# Altium schematic sheet Interface.SchDoc
size A3; SheetNumber: 1; SheetTotal: 10
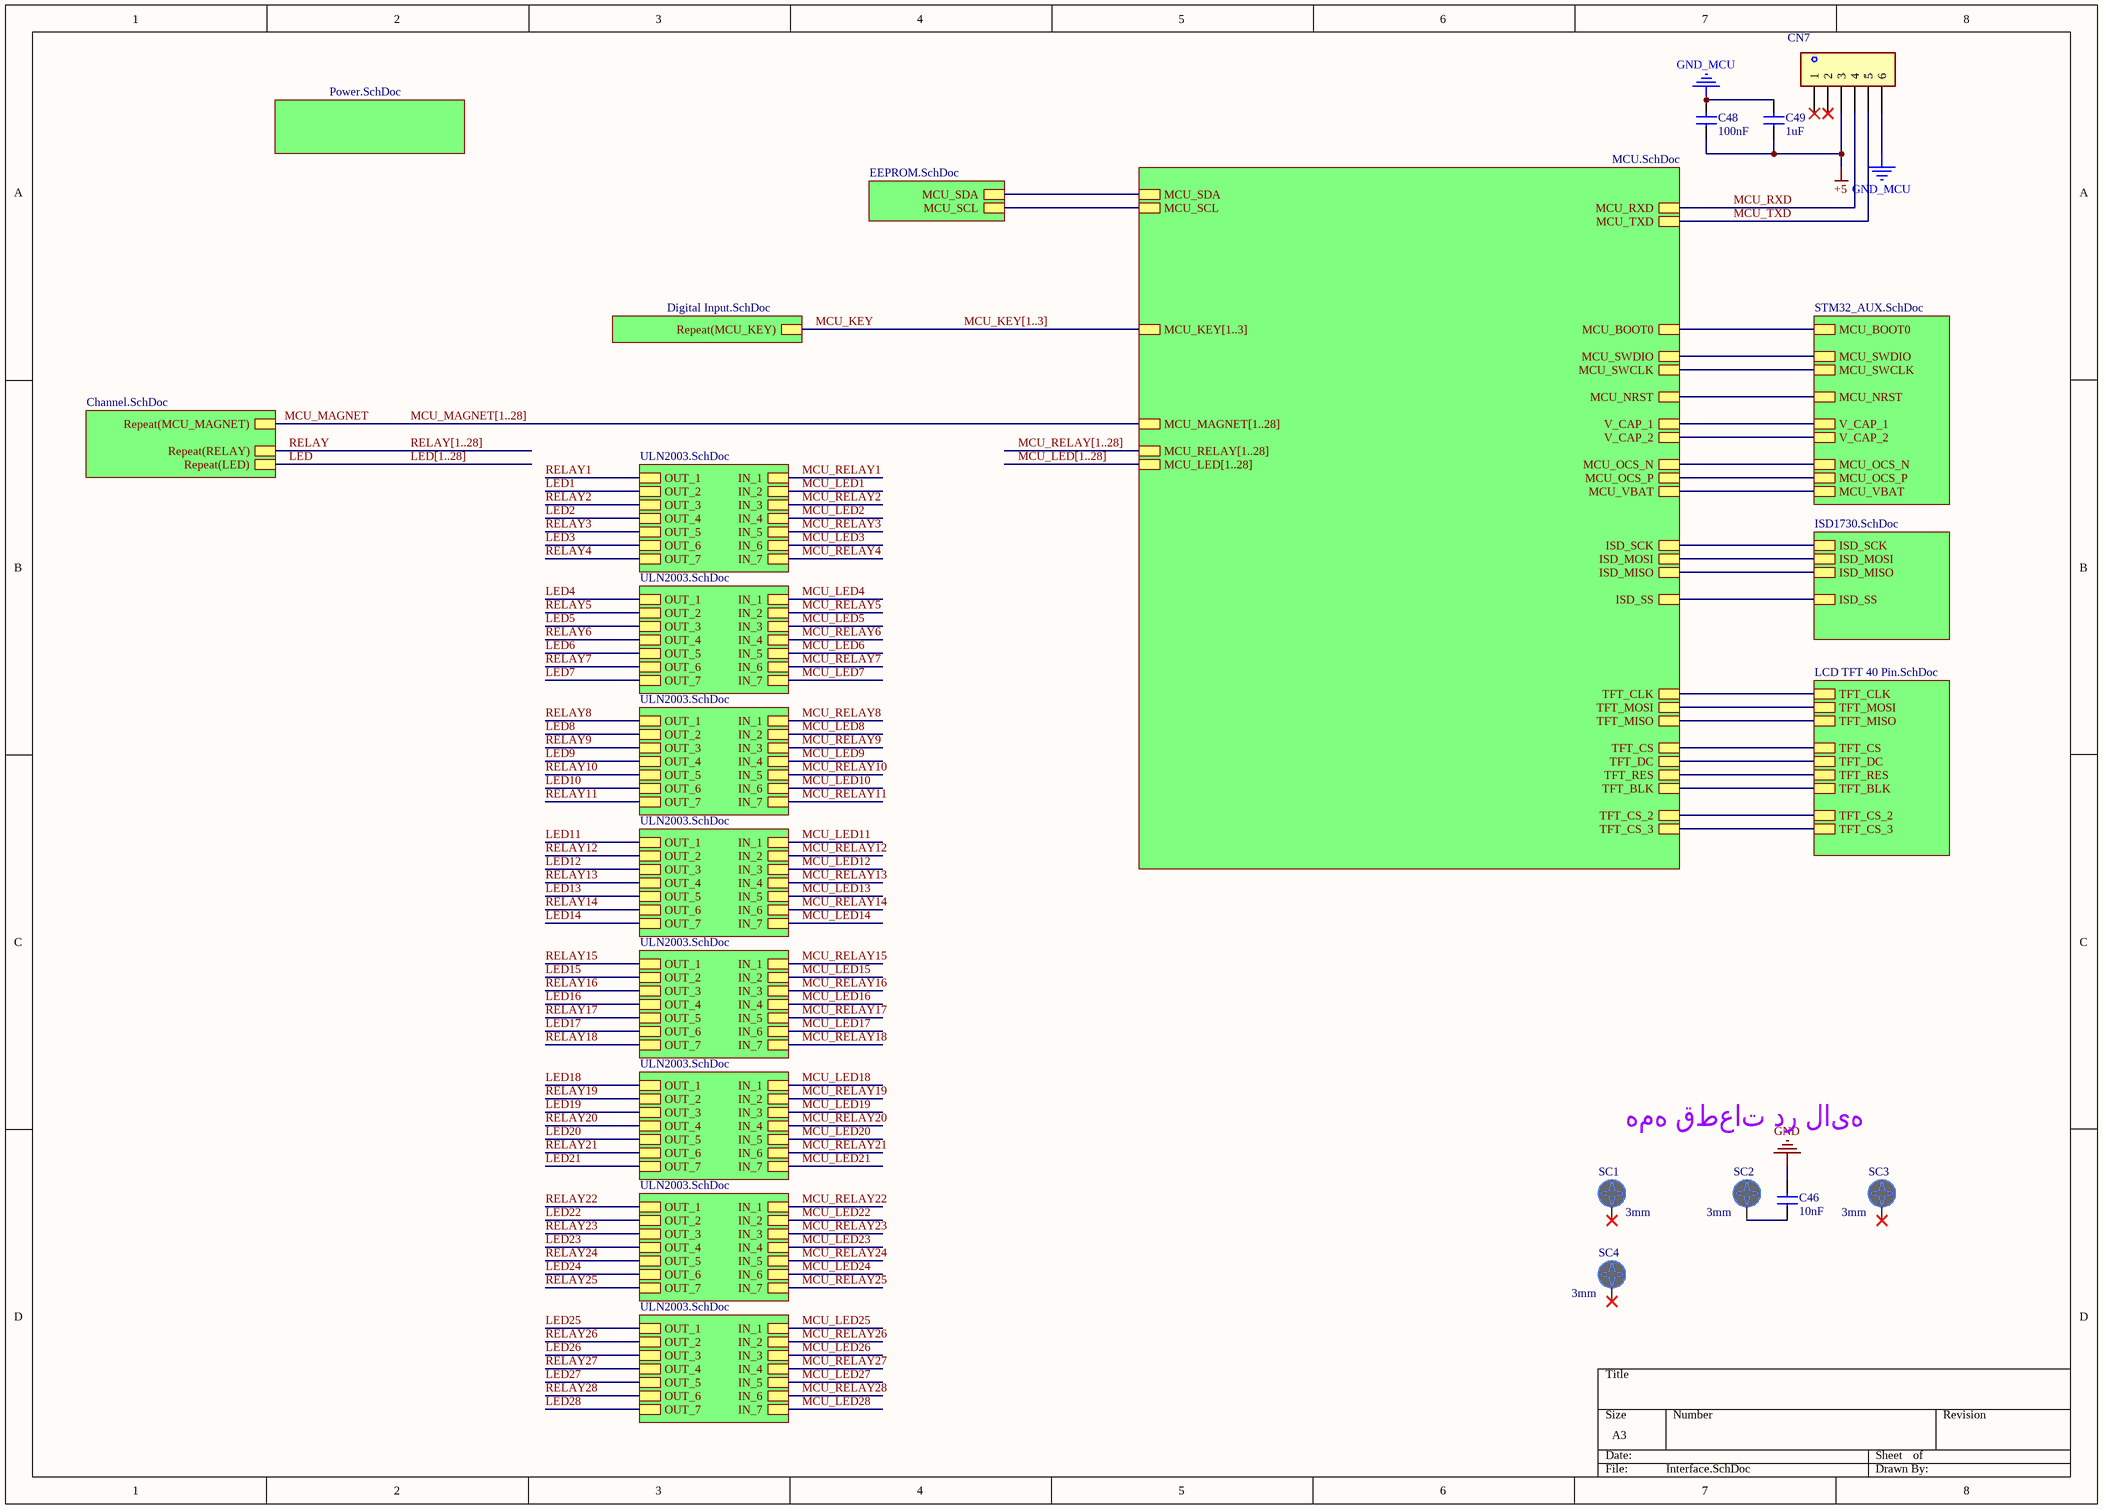
[diagram p0: Interface.SchDoc]

## Parts
C46  value 10nF  [CAP-CER-13x5-Ls10]  (hidden comment: CAP Cer 10nF-1KV-X7R-THD)
C48  value 100nF  [C-0805]  (hidden comment: CAP Cer 100nF-50V-X7R-SMD)
C49  value 1uF  [C-0805]  (hidden comment: CAP Cer 1uF-50V-X7R-SMD)
CN7  Connector XH/VH/TE-Straight/Right-THD/SMD-?mm  [XH-6]  (value not drawn)
SC1  Size: 3mm  [Screw_M3]  (hidden comment: Screw 3mm)
SC2  Size: 3mm  [Screw_M3]  (hidden comment: Screw 3mm)
SC3  Size: 3mm  [Screw_M3]  (hidden comment: Screw 3mm)
SC4  Size: 3mm  [Screw_M3]  (hidden comment: Screw 3mm)

## Sub-sheets
EEPROM = EEPROM.SchDoc: MCU_SDA, MCU_SCL
ISD1730 = ISD1730.SchDoc: ISD_SCK, ISD_MOSI, ISD_MISO, ISD_SS
MCU = MCU.SchDoc: MCU_BOOT0, MCU_SWCLK, MCU_SWDIO, MCU_NRST, V_CAP_1, V_CAP_2, MCU_OCS_N, MCU_OCS_P, TFT_CS, TFT_CLK, TFT_DC, TFT_MOSI, TFT_MISO, TFT_RES, TFT_BLK, ISD_SCK, ISD_MOSI, ISD_MISO, ISD_SS, MCU_SDA, MCU_SCL, MCU_KEY[1..3], MCU_RELAY[1..28], MCU_LED[1..28], MCU_MAGNET[1..28], MCU_TXD, MCU_RXD, MCU_VBAT, TFT_CS_2, TFT_CS_3
Power = Power.SchDoc: no entries
Repeat(CHANNEL, 1, 28) = Channel.SchDoc: Repeat(RELAY), Repeat(LED), Repeat(MCU_MAGNET)
Repeat(KEY, 1, 3) = Digital Input.SchDoc: Repeat(MCU_KEY)
STM_AUX = STM32_AUX.SchDoc: MCU_BOOT0, MCU_SWCLK, MCU_SWDIO, MCU_NRST, V_CAP_1, V_CAP_2, MCU_OCS_N, MCU_OCS_P, MCU_VBAT
TFT = LCD TFT 40 Pin.SchDoc: TFT_CS, TFT_CLK, TFT_DC, TFT_MOSI, TFT_MISO, TFT_RES, TFT_BLK, TFT_CS_2, TFT_CS_3
ULN2003_1 = ULN2003.SchDoc: IN_1, IN_2, IN_3, IN_4, IN_5, IN_6, IN_7, OUT_1, OUT_2, OUT_3, OUT_4, OUT_5, OUT_6, OUT_7
ULN2003_2 = ULN2003.SchDoc: IN_1, IN_2, IN_3, IN_4, IN_5, IN_6, IN_7, OUT_1, OUT_2, OUT_3, OUT_4, OUT_5, OUT_6, OUT_7
ULN2003_3 = ULN2003.SchDoc: IN_1, IN_2, IN_3, IN_4, IN_5, IN_6, IN_7, OUT_1, OUT_2, OUT_3, OUT_4, OUT_5, OUT_6, OUT_7
ULN2003_4 = ULN2003.SchDoc: IN_1, IN_2, IN_3, IN_4, IN_5, IN_6, IN_7, OUT_1, OUT_2, OUT_3, OUT_4, OUT_5, OUT_6, OUT_7
ULN2003_5 = ULN2003.SchDoc: IN_1, IN_2, IN_3, IN_4, IN_5, IN_6, IN_7, OUT_1, OUT_2, OUT_3, OUT_4, OUT_5, OUT_6, OUT_7
ULN2003_6 = ULN2003.SchDoc: IN_1, IN_2, IN_3, IN_4, IN_5, IN_6, IN_7, OUT_1, OUT_2, OUT_3, OUT_4, OUT_5, OUT_6, OUT_7
ULN2003_7 = ULN2003.SchDoc: IN_1, IN_2, IN_3, IN_4, IN_5, IN_6, IN_7, OUT_1, OUT_2, OUT_3, OUT_4, OUT_5, OUT_6, OUT_7
ULN2003_8 = ULN2003.SchDoc: IN_1, IN_2, IN_3, IN_4, IN_5, IN_6, IN_7, OUT_1, OUT_2, OUT_3, OUT_4, OUT_5, OUT_6, OUT_7

## Nets
+5: C48.1 C49.1 CN7.3
GND: C46.2
GND_MCU: C48.2 C49.2 CN7.6
LED: sheet Repeat(CHANNEL, 1, 28)/Repeat(LED)
LED1: sheet ULN2003_1/OUT_2
LED2: sheet ULN2003_1/OUT_4
LED3: sheet ULN2003_1/OUT_6
LED4: sheet ULN2003_2/OUT_1
LED5: sheet ULN2003_2/OUT_3
LED6: sheet ULN2003_2/OUT_5
LED7: sheet ULN2003_2/OUT_7
LED8: sheet ULN2003_3/OUT_2
LED9: sheet ULN2003_3/OUT_4
LED10: sheet ULN2003_3/OUT_6
LED11: sheet ULN2003_4/OUT_1
LED12: sheet ULN2003_4/OUT_3
LED13: sheet ULN2003_4/OUT_5
LED14: sheet ULN2003_4/OUT_7
LED15: sheet ULN2003_5/OUT_2
LED16: sheet ULN2003_5/OUT_4
LED17: sheet ULN2003_5/OUT_6
LED18: sheet ULN2003_6/OUT_1
LED19: sheet ULN2003_6/OUT_3
LED20: sheet ULN2003_6/OUT_5
LED21: sheet ULN2003_6/OUT_7
LED22: sheet ULN2003_7/OUT_2
LED23: sheet ULN2003_7/OUT_4
LED24: sheet ULN2003_7/OUT_6
LED25: sheet ULN2003_8/OUT_1
LED26: sheet ULN2003_8/OUT_3
LED27: sheet ULN2003_8/OUT_5
LED28: sheet ULN2003_8/OUT_7
MCU_KEY: sheet Repeat(KEY, 1, 3)/Repeat(MCU_KEY)  [also labelled MCU_KEY[1..3]]
MCU_LED1: sheet ULN2003_1/IN_2
MCU_LED2: sheet ULN2003_1/IN_4
MCU_LED3: sheet ULN2003_1/IN_6
MCU_LED4: sheet ULN2003_2/IN_1
MCU_LED5: sheet ULN2003_2/IN_3
MCU_LED6: sheet ULN2003_2/IN_5
MCU_LED7: sheet ULN2003_2/IN_7
MCU_LED8: sheet ULN2003_3/IN_2
MCU_LED9: sheet ULN2003_3/IN_4
MCU_LED10: sheet ULN2003_3/IN_6
MCU_LED11: sheet ULN2003_4/IN_1
MCU_LED12: sheet ULN2003_4/IN_3
MCU_LED13: sheet ULN2003_4/IN_5
MCU_LED14: sheet ULN2003_4/IN_7
MCU_LED15: sheet ULN2003_5/IN_2
MCU_LED16: sheet ULN2003_5/IN_4
MCU_LED17: sheet ULN2003_5/IN_6
MCU_LED18: sheet ULN2003_6/IN_1
MCU_LED19: sheet ULN2003_6/IN_3
MCU_LED20: sheet ULN2003_6/IN_5
MCU_LED21: sheet ULN2003_6/IN_7
MCU_LED22: sheet ULN2003_7/IN_2
MCU_LED23: sheet ULN2003_7/IN_4
MCU_LED24: sheet ULN2003_7/IN_6
MCU_LED25: sheet ULN2003_8/IN_1
MCU_LED26: sheet ULN2003_8/IN_3
MCU_LED27: sheet ULN2003_8/IN_5
MCU_LED28: sheet ULN2003_8/IN_7
MCU_MAGNET: sheet Repeat(CHANNEL, 1, 28)/Repeat(MCU_MAGNET)
MCU_RELAY1: sheet ULN2003_1/IN_1
MCU_RELAY2: sheet ULN2003_1/IN_3
MCU_RELAY3: sheet ULN2003_1/IN_5
MCU_RELAY4: sheet ULN2003_1/IN_7
MCU_RELAY5: sheet ULN2003_2/IN_2
MCU_RELAY6: sheet ULN2003_2/IN_4
MCU_RELAY7: sheet ULN2003_2/IN_6
MCU_RELAY8: sheet ULN2003_3/IN_1
MCU_RELAY9: sheet ULN2003_3/IN_3
MCU_RELAY10: sheet ULN2003_3/IN_5
MCU_RELAY11: sheet ULN2003_3/IN_7
MCU_RELAY12: sheet ULN2003_4/IN_2
MCU_RELAY13: sheet ULN2003_4/IN_4
MCU_RELAY14: sheet ULN2003_4/IN_6
MCU_RELAY15: sheet ULN2003_5/IN_1
MCU_RELAY16: sheet ULN2003_5/IN_3
MCU_RELAY17: sheet ULN2003_5/IN_5
MCU_RELAY18: sheet ULN2003_5/IN_7
MCU_RELAY19: sheet ULN2003_6/IN_2
MCU_RELAY20: sheet ULN2003_6/IN_4
MCU_RELAY21: sheet ULN2003_6/IN_6
MCU_RELAY22: sheet ULN2003_7/IN_1
MCU_RELAY23: sheet ULN2003_7/IN_3
MCU_RELAY24: sheet ULN2003_7/IN_5
MCU_RELAY25: sheet ULN2003_7/IN_7
MCU_RELAY26: sheet ULN2003_8/IN_2
MCU_RELAY27: sheet ULN2003_8/IN_4
MCU_RELAY28: sheet ULN2003_8/IN_6
MCU_RXD: CN7.4 ; sheet MCU/MCU_RXD
MCU_TXD: CN7.5 ; sheet MCU/MCU_TXD
RELAY: sheet Repeat(CHANNEL, 1, 28)/Repeat(RELAY)
RELAY1: sheet ULN2003_1/OUT_1
RELAY2: sheet ULN2003_1/OUT_3
RELAY3: sheet ULN2003_1/OUT_5
RELAY4: sheet ULN2003_1/OUT_7
RELAY5: sheet ULN2003_2/OUT_2
RELAY6: sheet ULN2003_2/OUT_4
RELAY7: sheet ULN2003_2/OUT_6
RELAY8: sheet ULN2003_3/OUT_1
RELAY9: sheet ULN2003_3/OUT_3
RELAY10: sheet ULN2003_3/OUT_5
RELAY11: sheet ULN2003_3/OUT_7
RELAY12: sheet ULN2003_4/OUT_2
RELAY13: sheet ULN2003_4/OUT_4
RELAY14: sheet ULN2003_4/OUT_6
RELAY15: sheet ULN2003_5/OUT_1
RELAY16: sheet ULN2003_5/OUT_3
RELAY17: sheet ULN2003_5/OUT_5
RELAY18: sheet ULN2003_5/OUT_7
RELAY19: sheet ULN2003_6/OUT_2
RELAY20: sheet ULN2003_6/OUT_4
RELAY21: sheet ULN2003_6/OUT_6
RELAY22: sheet ULN2003_7/OUT_1
RELAY23: sheet ULN2003_7/OUT_3
RELAY24: sheet ULN2003_7/OUT_5
RELAY25: sheet ULN2003_7/OUT_7
RELAY26: sheet ULN2003_8/OUT_2
RELAY27: sheet ULN2003_8/OUT_4
RELAY28: sheet ULN2003_8/OUT_6
NetC46_1: C46.1 SC2.1
(unnamed): sheet MCU/MCU_BOOT0, sheet STM_AUX/MCU_BOOT0
(unnamed): sheet MCU/MCU_SWCLK, sheet STM_AUX/MCU_SWCLK
(unnamed): sheet MCU/MCU_SWDIO, sheet STM_AUX/MCU_SWDIO
(unnamed): sheet MCU/MCU_NRST, sheet STM_AUX/MCU_NRST
(unnamed): sheet MCU/V_CAP_1, sheet STM_AUX/V_CAP_1
(unnamed): sheet MCU/V_CAP_2, sheet STM_AUX/V_CAP_2
(unnamed): sheet MCU/MCU_OCS_N, sheet STM_AUX/MCU_OCS_N
(unnamed): sheet MCU/MCU_OCS_P, sheet STM_AUX/MCU_OCS_P
(unnamed): sheet MCU/TFT_CS, sheet TFT/TFT_CS
(unnamed): sheet MCU/TFT_CLK, sheet TFT/TFT_CLK
(unnamed): sheet MCU/TFT_DC, sheet TFT/TFT_DC
(unnamed): sheet MCU/TFT_MOSI, sheet TFT/TFT_MOSI
(unnamed): sheet MCU/TFT_MISO, sheet TFT/TFT_MISO
(unnamed): sheet MCU/TFT_RES, sheet TFT/TFT_RES
(unnamed): sheet MCU/TFT_BLK, sheet TFT/TFT_BLK
(unnamed): sheet MCU/ISD_SCK, sheet ISD1730/ISD_SCK
(unnamed): sheet MCU/ISD_MOSI, sheet ISD1730/ISD_MOSI
(unnamed): sheet MCU/ISD_MISO, sheet ISD1730/ISD_MISO
(unnamed): sheet MCU/ISD_SS, sheet ISD1730/ISD_SS
(unnamed): sheet MCU/MCU_SDA, sheet EEPROM/MCU_SDA
(unnamed): sheet MCU/MCU_SCL, sheet EEPROM/MCU_SCL
(unnamed): sheet MCU/MCU_VBAT, sheet STM_AUX/MCU_VBAT
(unnamed): sheet MCU/TFT_CS_2, sheet TFT/TFT_CS_2
(unnamed): sheet MCU/TFT_CS_3, sheet TFT/TFT_CS_3

Not connected (* = marked no-connect by the designer): CN7 1* 2*; SC1 1*; SC3 1*; SC4 1*

## Buses and harness runs
bus LED[1..28]
bus MCU_LED[1..28] = sheet MCU/MCU_LED[1..28]
bus MCU_MAGNET[1..28] = sheet MCU/MCU_MAGNET[1..28]
bus MCU_RELAY[1..28] = sheet MCU/MCU_RELAY[1..28]
bus RELAY[1..28]

## Notes on the sheet
- همه قطعات در لایه بالا قرار بگیرند

## Library data of the parts
C46 = CAP-CER: CAPACITOR; Phone Number: 0915 8700 314; Voltage: 1KV; Tolerance: X7R; Type: THD; Publisher: Mahdi Bagherzadeh; ComponentLink1Description: Linkedin; ComponentLink1URL: https://ir.linkedin.com/in/mahdi-bagherzade; Published Date: 9-15-2024
C48 C49 = CAP-CER: CAPACITOR; Phone Number: 0915 8700 314; Voltage: 50V; Tolerance: X7R; Type: SMD; Publisher: Mahdi Bagherzadeh; ComponentLink1Description: Linkedin; ComponentLink1URL: https://ir.linkedin.com/in/mahdi-bagherzade; Published Date: 9-15-2024
CN7 = CN-6pin: CONNECTOR; Phone Number: 0915 8700 314; Publisher: Mahdi Bagherzadeh; ComponentLink1Description: Linkedin; ComponentLink1URL: https://ir.linkedin.com/in/mahdi-bagherzade; Published Date: 9-15-2024; Size: ?mm; Type: Straight/Right-THD/SMD; Value: XH/VH/TE
SC1-SC4 = SCREW: Phone Number: 0915 8700 314; Publisher: Mahdi Bagherzadeh; ComponentLink1Description: Linkedin; ComponentLink1URL: https://ir.linkedin.com/in/mahdi-bagherzade; Published Date: 9-15-2024